# Altium schematic sheet PDB_schematic.SchDoc
size 594 x 420 mm; Organization: ORGANIZATION; Address1: ADDRESS 1; Address2: ADDRESS 2; Address3: ADDRESS 3; Address4: ADDRESS 4; Revision: -; SheetNumber: 1; SheetTotal: 1; ENG_APP_DATE: --/--/--; DSN_APP_DATE: --/--/--; CHK_APP_DATE: --/--/--
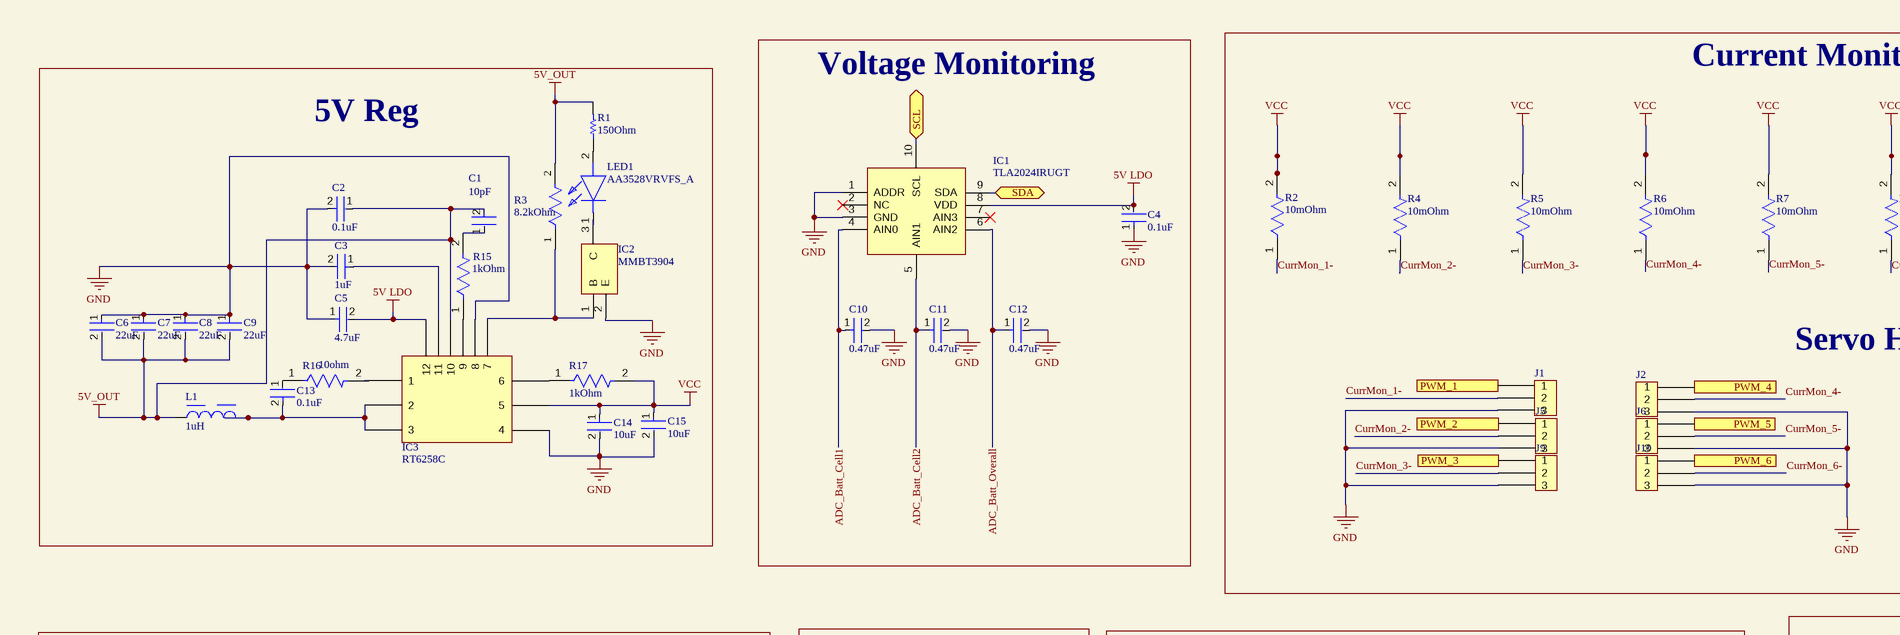
[diagram p0: PDB_schematic.SchDoc, top left]
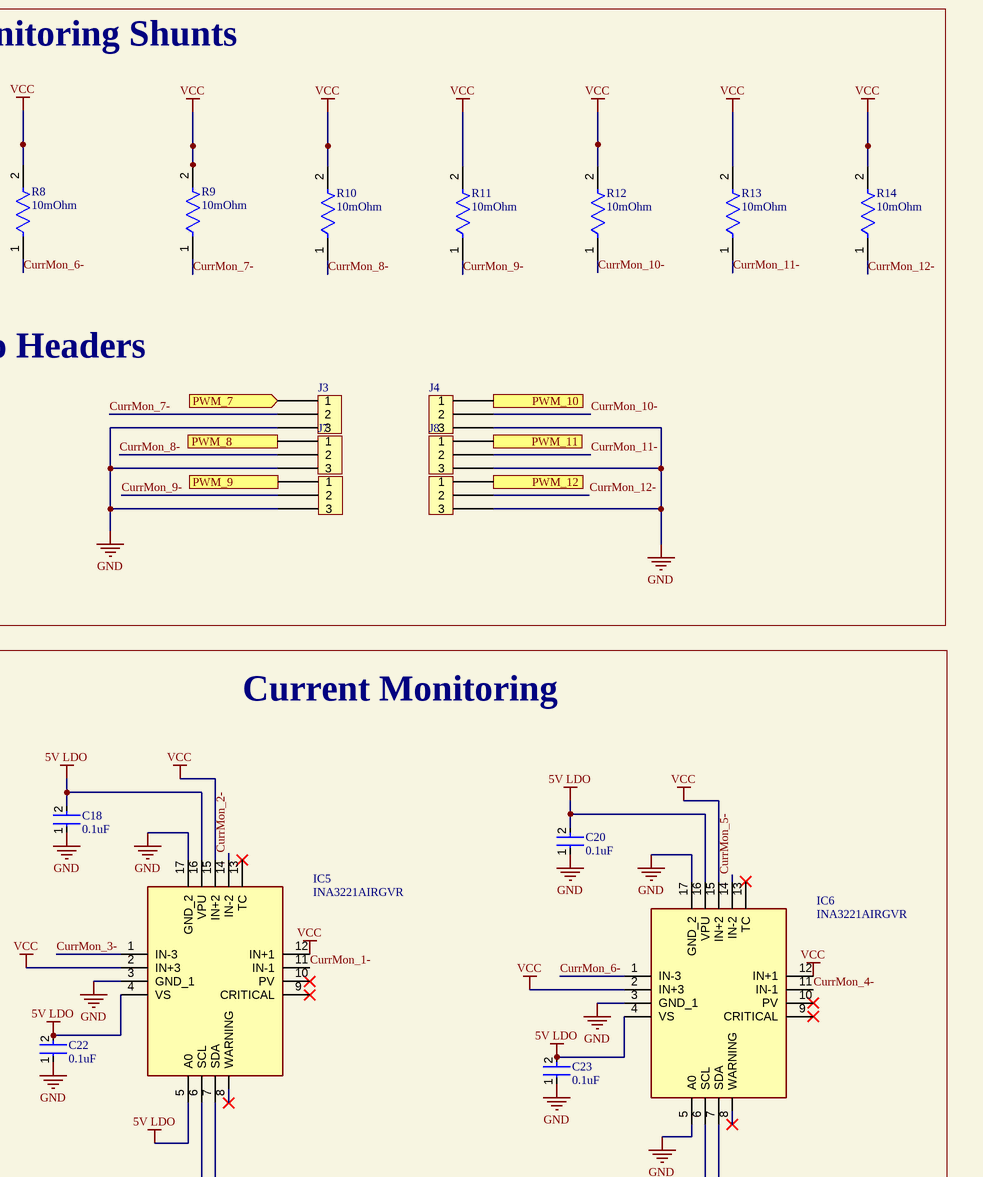
[diagram p1: PDB_schematic.SchDoc, top right]
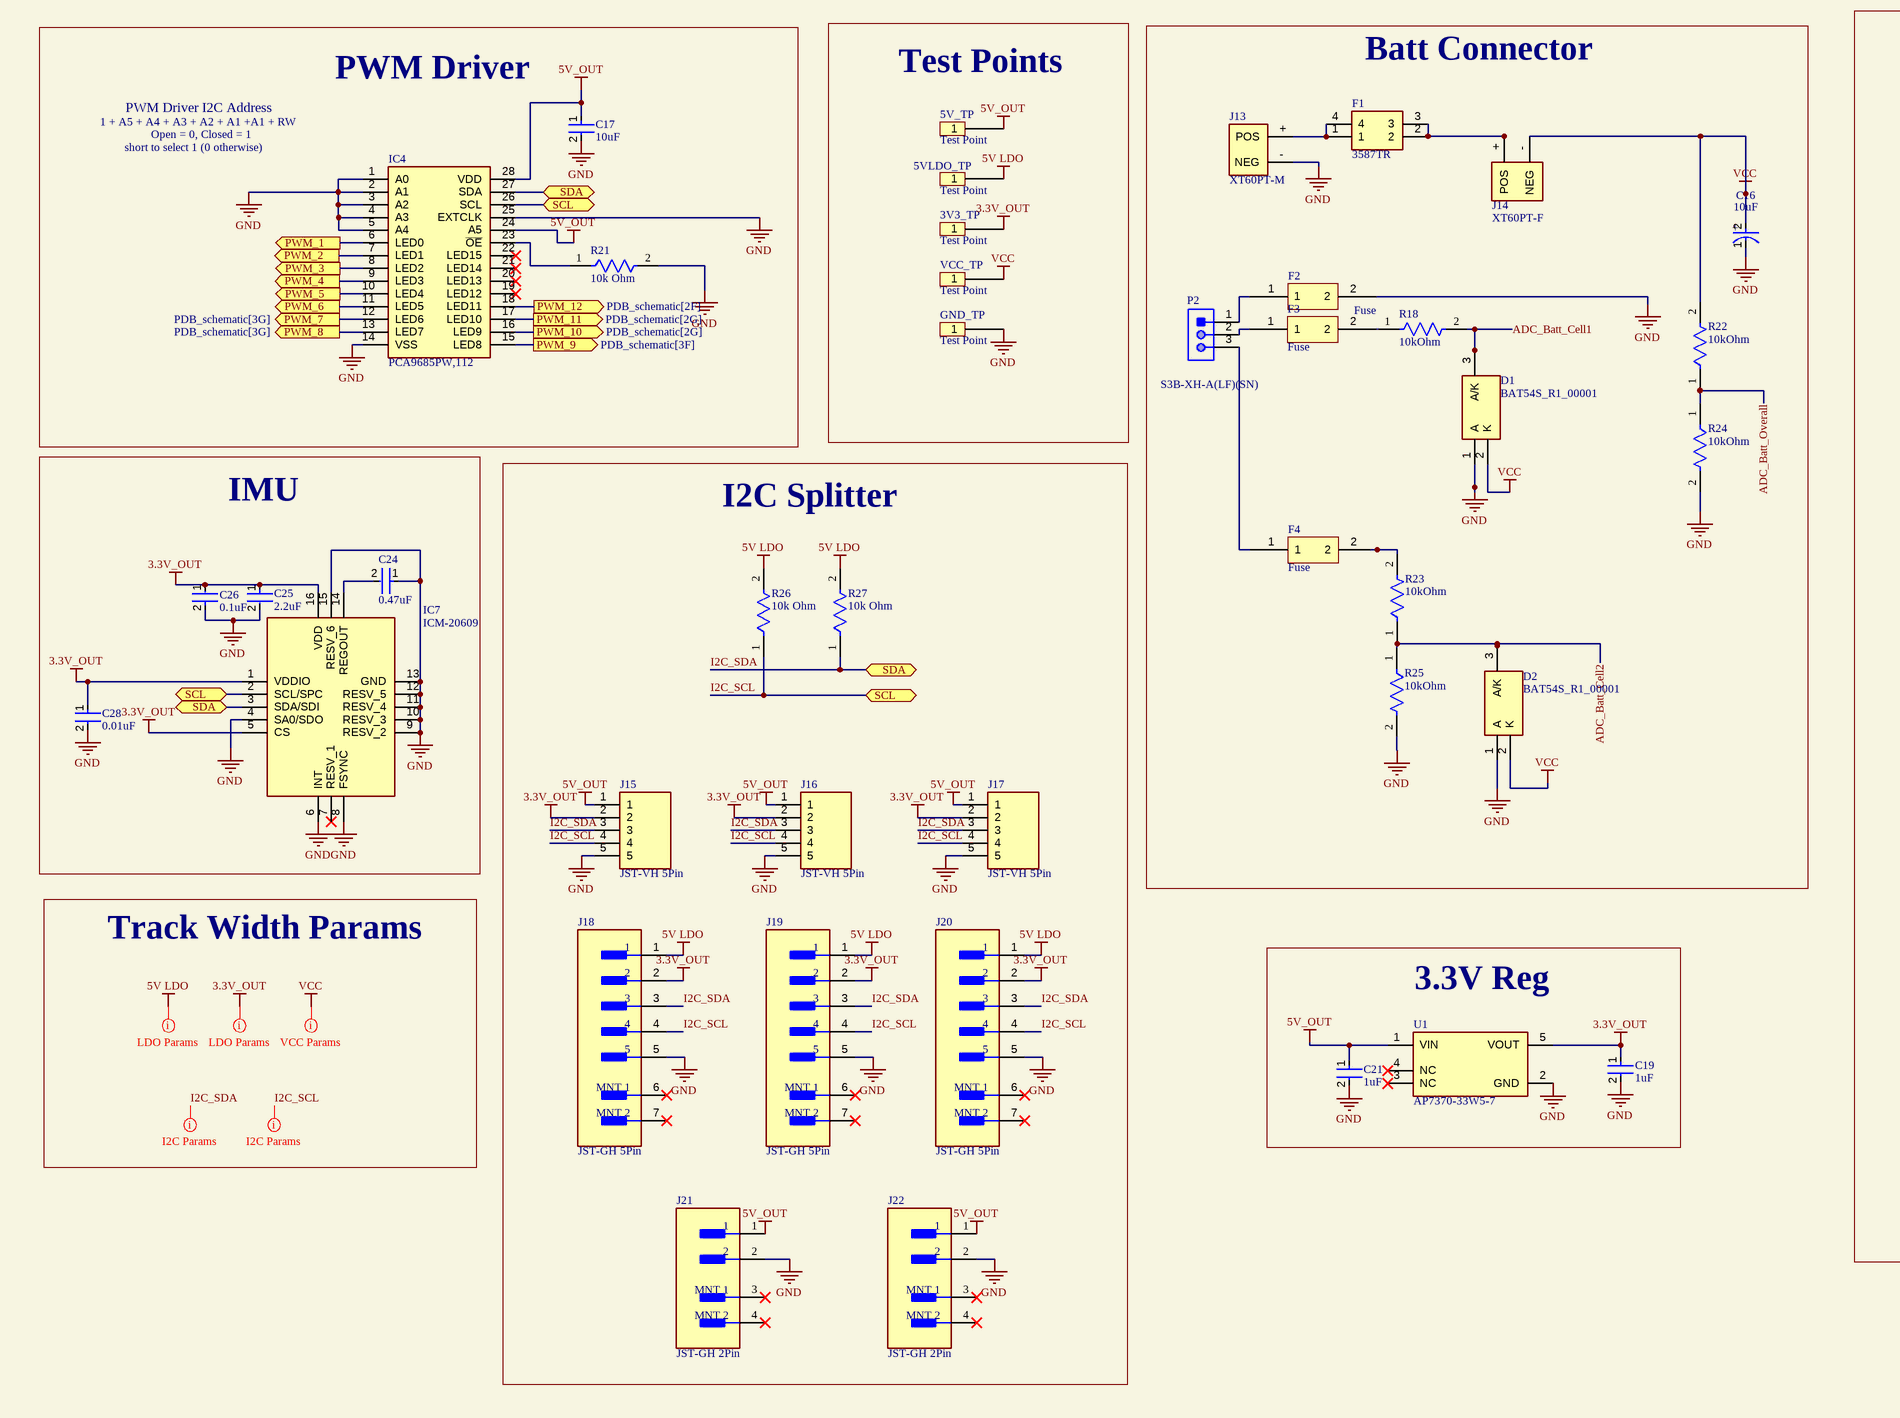
[diagram p2: PDB_schematic.SchDoc, bottom left]
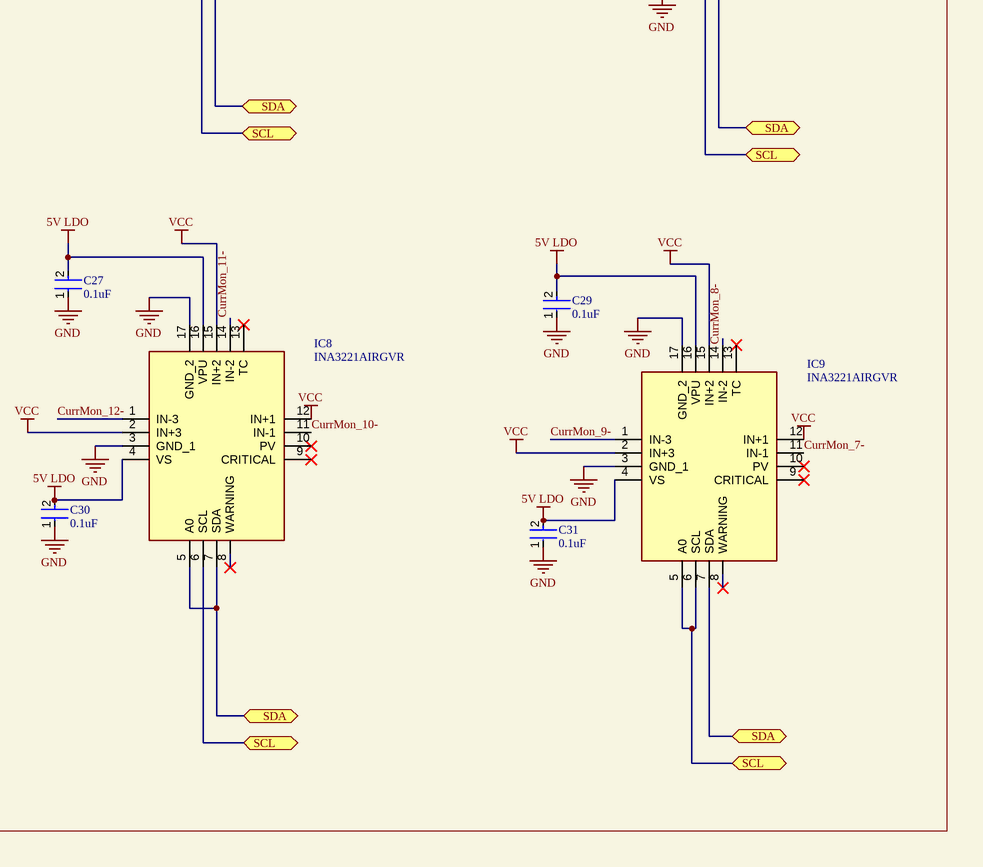
[diagram p3: PDB_schematic.SchDoc, bottom right]

## Parts
3V3_TP  Test Point  [Test Point]
5V_TP  Test Point  [Test Point]
5VLDO_TP  Test Point  [Test Point]
C1  10pF  [FP-C1608-080-0_1-IPC_B]
C2  0.1uF  [FP-GCJ188-0_2-IPC_B]
C3  1uF  [FP-0603-L_1_6_0_15-W_0_81-IPC_B]
C4  0.1uF  [FP-C0603-CJ-IPC_B]
C5  4.7uF  [FP-GRM188-0_2-IPC_B]
C6  22uF  [FP-CL10-IPC_B]
C7  22uF  [FP-CL10-IPC_B]
C8  22uF  [FP-CL10-IPC_B]
C9  22uF  [FP-CL10-IPC_B]
C10  0.47uF  [FP-GRM188-0_1-e0_2_0_5-IPC_B]
C11  0.47uF  [FP-GRM188-0_1-e0_2_0_5-IPC_B]
C12  0.47uF  [FP-GRM188-0_1-e0_2_0_5-IPC_B]
C13  0.1uF  [FP-GCJ188-0_2-IPC_B]
C14  10uF  [FP-GRM188-0_2-IPC_B]
C15  10uF  [FP-GRM188-0_2-IPC_B]
C16  10uF  [FP-FKD-MFG]
C17  10uF  [FP-GRM188-0_1-e0_2_0_55-IPC_B]
C18  0.1uF  [FP-GCJ188-0_2-IPC_B]
C19  1uF  [FP-0603-L_1_6_0_15-W_0_81-IPC_B]
C20  0.1uF  [FP-GCJ188-0_2-IPC_B]
C21  1uF  [FP-0603-L_1_6_0_15-W_0_81-IPC_B]
C22  0.1uF  [FP-GCJ188-0_2-IPC_B]
C23  0.1uF  [FP-GCJ188-0_2-IPC_B]
C24  0.47uF  [FP-GRM188-0_1-e0_2_0_5-IPC_B]
C25  2.2uF  [FP-GRM188-0_1-e0_2_0_5-IPC_B]
C26  0.1uF  [FP-GCJ188-0_2-IPC_B]
C27  0.1uF  [FP-GCJ188-0_2-IPC_B]
C28  0.01uF  [FP-C0603C-CF-IPC_B]
C29  0.1uF  [FP-GCJ188-0_2-IPC_B]
C30  0.1uF  [FP-GCJ188-0_2-IPC_B]
C31  0.1uF  [FP-GCJ188-0_2-IPC_B]
D1  BAT54S_R1_00001  [SOT95P240X110-3N]
D2  BAT54S_R1_00001  [SOT95P240X110-3N]
F1  3587TR  [3587TR]
F2  Fuse  [0805L002YR]
F3  Fuse  [0805L002YR]
F4  Fuse  [0805L002YR]
GND_TP  Test Point  [Test Point]
IC1  TLA2024IRUGT  [ADS1018IRUGT]
IC2  MMBT3904  [SOT95P240X120-3N]
IC3  RT6258C  [RT6258C]
IC4  PCA9685PW,112  [SOP65P640X110-28N]
IC5  INA3221AIRGVR  [QFN65P400X400X100-17N-D]
IC6  INA3221AIRGVR  [QFN65P400X400X100-17N-D]
IC7  ICM-20609  [IAM20680HP]
IC8  INA3221AIRGVR  [QFN65P400X400X100-17N-D]
IC9  INA3221AIRGVR  [QFN65P400X400X100-17N-D]
J1  1x3 dupont  [1x3 Dupont]  (value not drawn)
J2  1x3 dupont  [1x3 Dupont]  (value not drawn)
J3  1x3 dupont  [1x3 Dupont]  (value not drawn)
J4  1x3 dupont  [1x3 Dupont]  (value not drawn)
J5  1x3 dupont  [1x3 Dupont]  (value not drawn)
J6  1x3 dupont  [1x3 Dupont]  (value not drawn)
J7  1x3 dupont  [1x3 Dupont]  (value not drawn)
J8  1x3 dupont  [1x3 Dupont]  (value not drawn)
J9  1x3 dupont  [1x3 Dupont]  (value not drawn)
J10  1x3 dupont  [1x3 Dupont]  (value not drawn)
J11  1x3 dupont  [1x3 Dupont]  (value not drawn)
J12  1x3 dupont  [1x3 Dupont]  (value not drawn)
J13  XT60PT-M  [XT60PT-M]
J14  XT60PT-F  [XT60PT-F]
J15  JST-VH 5Pin  [SHDR5W114P0X396_1X5_1974X850X1090P]
J16  JST-VH 5Pin  [SHDR5W114P0X396_1X5_1974X850X1090P]
J17  JST-VH 5Pin  [SHDR5W114P0X396_1X5_1974X850X1090P]
J18  JST-GH 5Pin  [FP-BM05B-GHS-TBT_LF_SN-MFG]
J19  JST-GH 5Pin  [FP-BM05B-GHS-TBT_LF_SN-MFG]
J20  JST-GH 5Pin  [FP-BM05B-GHS-TBT_LF_SN-MFG]
J21  JST-GH 2Pin  [FP-BM02B-GHS-TBT_LF_SN-MFG]
J22  JST-GH 2Pin  [FP-BM02B-GHS-TBT_LF_SN-MFG]
L1  1uH  [WE-HCI_7040]
LED1  AA3528VRVFS_A  [AA3528VRVFSA]
P2  S3B-XH-A(LF)(SN)  [JST-S3B-XH-A(LF)(SN)_V]
R1  150Ohm  [RESC1608X55X30ML20T20]
R2  10mOhm  [FP-ERJ8CW-IPC_B]
R3  8.2kOhm  [FP-RC0603-0_55-MFG]
R4  10mOhm  [FP-ERJ8CW-IPC_B]
R5  10mOhm  [FP-ERJ8CW-IPC_B]
R6  10mOhm  [FP-ERJ8CW-IPC_B]
R7  10mOhm  [FP-ERJ8CW-IPC_B]
R8  10mOhm  [FP-ERJ8CW-IPC_B]
R9  10mOhm  [FP-ERJ8CW-IPC_B]
R10  10mOhm  [FP-ERJ8CW-IPC_B]
R11  10mOhm  [FP-ERJ8CW-IPC_B]
R12  10mOhm  [FP-ERJ8CW-IPC_B]
R13  10mOhm  [FP-ERJ8CW-IPC_B]
R14  10mOhm  [FP-ERJ8CW-IPC_B]
R15  1kOhm  [FP-ERJ3G-IPC_B]
R16  10ohm  [FP-CR0603-IPC_B]
R17  1kOhm  [FP-ERJ3G-IPC_B]
R18  10kOhm  [FP-ERA3A-IPC_B]
R21  10k Ohm  [FP-ERA3A-IPC_B]
R22  10kOhm  [FP-ERA3A-IPC_B]
R23  10kOhm  [FP-ERA3A-IPC_B]
R24  10kOhm  [FP-ERA3A-IPC_B]
R25  10kOhm  [FP-ERA3A-IPC_B]
R26  10k Ohm  [FP-ERA3A-IPC_B]
R27  10k Ohm  [FP-ERA3A-IPC_B]
U1  AP7370-33W5-7  [FP-SOT25-MFG]
VCC_TP  Test Point  [Test Point]

## Blocks framed on the sheet
Voltage Monitoring: C4 C10-C12 IC1
5V Reg: C1-C3 C5-C9 C13-C15 IC2 IC3 L1 LED1 R1 R3 R15-R17
Test Points: 3V3_TP 5V_TP 5VLDO_TP GND_TP VCC_TP
Batt Connector: C16 D1 D2 F1-F4 J13 J14 P2 R18 R22-R25
Current Monitoring: C18 C20 C22 C23 C27 C29-C31 IC5 IC6 IC8 IC9
PWM Driver: C17 IC4 R21
IMU: C24-C26 C28 IC7
I2C Splitter: J15-J22 R26 R27
3.3V Reg: C19 C21 U1

## Ports
PWM_1 (in, see PDB_schematic[9E]), PWM_1 (out, see PDB_schematic[5G]), PWM_2 (in, see PDB_schematic[9E]), PWM_2 (out, see PDB_schematic[5G]), PWM_3 (in, see PDB_schematic[9E]), PWM_3 (out, see PDB_schematic[5F]), PWM_4 (in, see PDB_schematic[9E]), PWM_4 (out, see PDB_schematic[5G]), PWM_5 (in, see PDB_schematic[9E]), PWM_5 (out, see PDB_schematic[5G]), PWM_6 (in, see PDB_schematic[9E]), PWM_6 (out, see PDB_schematic[5F]), PWM_7 (in, see PDB_schematic[9E]), PWM_7 (out, see PDB_schematic[3G]), PWM_8 (in, see PDB_schematic[9E]), PWM_8 (out, see PDB_schematic[3G]), PWM_9 (in, see PDB_schematic[9E]), PWM_9 (out, see PDB_schematic[3F]), PWM_10 (in, see PDB_schematic[9E]), PWM_10 (out, see PDB_schematic[2G]), PWM_11 (in, see PDB_schematic[9E]), PWM_11 (out, see PDB_schematic[2G]), PWM_12 (in, see PDB_schematic[9E]), PWM_12 (out, see PDB_schematic[2F]), SCL (bidir, see PDB_schematic[2A], PDB_schematic[2D], PDB_schematic[3A], PDB_schematic[3D], PDB_schematic[7H], PDB_schematic[8C], PDB_schematic[9E]), SCL (bidir, see PDB_schematic[2A], PDB_schematic[2D], PDB_schematic[3A], PDB_schematic[3D], PDB_schematic[7H], PDB_schematic[8C], PDB_schematic[10C]), SCL (bidir, see PDB_schematic[2A], PDB_schematic[2D], PDB_schematic[3A], PDB_schematic[3D], PDB_schematic[7H], PDB_schematic[9E], PDB_schematic[10C]), SCL (bidir, see PDB_schematic[2A], PDB_schematic[2D], PDB_schematic[3A], PDB_schematic[3D], PDB_schematic[8C], PDB_schematic[9E], PDB_schematic[10C]), SCL (bidir, see PDB_schematic[2A], PDB_schematic[2D], PDB_schematic[3A], PDB_schematic[7H], PDB_schematic[8C], PDB_schematic[9E], PDB_schematic[10C]), SCL (bidir, see PDB_schematic[2A], PDB_schematic[2D], PDB_schematic[3D], PDB_schematic[7H], PDB_schematic[8C], PDB_schematic[9E], PDB_schematic[10C]), SCL (bidir, see PDB_schematic[2A], PDB_schematic[3A], PDB_schematic[3D], PDB_schematic[7H], PDB_schematic[8C], PDB_schematic[9E], PDB_schematic[10C]), SCL (bidir, see PDB_schematic[2D], PDB_schematic[3A], PDB_schematic[3D], PDB_schematic[7H], PDB_schematic[8C], PDB_schematic[9E], PDB_schematic[10C]), SDA (bidir, see PDB_schematic[2A], PDB_schematic[2D], PDB_schematic[3B], PDB_schematic[3D], PDB_schematic[7H], PDB_schematic[8C], PDB_schematic[9E]), SDA (bidir, see PDB_schematic[2A], PDB_schematic[2D], PDB_schematic[3B], PDB_schematic[3D], PDB_schematic[7H], PDB_schematic[8C], PDB_schematic[10C]), SDA (bidir, see PDB_schematic[2A], PDB_schematic[2D], PDB_schematic[3B], PDB_schematic[3D], PDB_schematic[7H], PDB_schematic[9E], PDB_schematic[10C]), SDA (bidir, see PDB_schematic[2A], PDB_schematic[2D], PDB_schematic[3B], PDB_schematic[3D], PDB_schematic[8C], PDB_schematic[9E], PDB_schematic[10C]), SDA (bidir, see PDB_schematic[2A], PDB_schematic[2D], PDB_schematic[3B], PDB_schematic[7H], PDB_schematic[8C], PDB_schematic[9E], PDB_schematic[10C]), SDA (bidir, see PDB_schematic[2A], PDB_schematic[2D], PDB_schematic[3D], PDB_schematic[7H], PDB_schematic[8C], PDB_schematic[9E], PDB_schematic[10C]), SDA (bidir, see PDB_schematic[2A], PDB_schematic[3B], PDB_schematic[3D], PDB_schematic[7H], PDB_schematic[8C], PDB_schematic[9E], PDB_schematic[10C]), SDA (bidir, see PDB_schematic[2D], PDB_schematic[3B], PDB_schematic[3D], PDB_schematic[7H], PDB_schematic[8C], PDB_schematic[9E], PDB_schematic[10C])

## Nets
3.3V_OUT: 3V3_TP.1 C19.1 C25.1 C26.1 C28.1 IC7.1(VDDIO) IC7.5(CS) IC7.16(VDD) J15.2 J16.2 J17.2 J18.2 J19.2 J20.2 U1.5(VOUT)
5V LDO: 5VLDO_TP.1 C4.2 C5.2 C18.2 C20.2 C22.2 C23.2 C27.2 C29.2 C30.2 C31.2 IC1.8(VDD) IC3.12 IC5.4(VS) IC5.5(A0) IC5.16(VPU) IC6.4(VS) IC6.16(VPU) IC8.4(VS) IC8.16(VPU) IC9.4(VS) IC9.16(VPU) J18.1 J19.1 J20.1 R26.2 R27.2
5V_OUT: 5V_TP.1 C1.2 C2.1 C6.2 C7.2 C8.2 C9.2 C17.1 C21.1 IC3.10 IC4.24(A5) IC4.28(VDD) J15.1 J16.1 J17.1 J21.1 J22.1 L1.1 R1.2 R3.2 U1.1(VIN)
GND: C2.2 C3.2 C4.1 C5.1 C6.1 C7.1 C8.1 C9.1 C10.2 C11.2 C12.2 C14.2 C15.2 C16.1(C) C17.2 C18.1 C19.2 C20.1 C21.2 C22.1 C23.1 C24.1 C25.2 C26.2 C27.1 C28.2 C29.1 C30.1 C31.1 D1.1(A) D2.1(A) F2.2 GND_TP.1 IC1.1(ADDR) IC1.3(GND) IC2.2(E) IC3.4 IC3.8 IC4.1(A0) IC4.2(A1) IC4.3(A2) IC4.4(A3) IC4.5(A4) IC4.14(VSS) IC4.25(EXTCLK) IC5.3(GND_1) IC5.17(GND_2) IC6.3(GND_1) IC6.5(A0) IC6.17(GND_2) IC7.4(SA0/SDO) IC7.6(INT) IC7.8(FSYNC) IC7.9(RESV_2) IC7.10(RESV_3) IC7.11(RESV_4) IC7.12(RESV_5) IC7.13(GND) IC7.15(RESV_6) IC8.3(GND_1) IC8.17(GND_2) IC9.3(GND_1) IC9.17(GND_2) J1.3 J2.3 J3.3 J4.3 J5.3 J6.3 J7.3 J8.3 J9.3 J10.3 J11.3 J12.3 J13.-(NEG) J15.5 J16.5 J17.5 J18.5 J19.5 J20.5 J21.2 J22.2 R21.2 R24.2 R25.2 U1.2(GND)
VCC: C14.1 C15.1 C16.2(A) D1.2(K) D2.2(K) IC3.5 IC5.2(IN+3) IC5.12(IN+1) IC5.15(IN+2) IC6.2(IN+3) IC6.12(IN+1) IC6.15(IN+2) IC8.2(IN+3) IC8.12(IN+1) IC8.15(IN+2) IC9.2(IN+3) IC9.12(IN+1) IC9.15(IN+2) J14.-(NEG) R2.2 R4.2 R5.2 R6.2 R7.2 R8.2 R9.2 R10.2 R11.2 R12.2 R13.2 R14.2 R17.2 R22.2 VCC_TP.1
ADC_Batt_Cell1: C10.1 D1.3(A/K) IC1.4(AIN0) R18.2
ADC_Batt_Cell2: C11.1 D2.3(A/K) IC1.5(AIN1) R23.1 R25.1
ADC_Batt_Overall: C12.1 IC1.6(AIN2) R22.1 R24.1
CurrMon_1-: IC5.11(IN-1) J1.2 R2.1
CurrMon_2-: IC5.14(IN-2) J5.2 R4.1
CurrMon_3-: IC5.1(IN-3) J9.2 R5.1
CurrMon_4-: IC6.11(IN-1) J2.2 R6.1
CurrMon_5-: IC6.14(IN-2) J6.2 R7.1
CurrMon_6-: IC6.1(IN-3) J10.2 R8.1
CurrMon_7-: IC9.11(IN-1) J3.2 R9.1
CurrMon_8-: IC9.14(IN-2) J7.2 R10.1
CurrMon_9-: IC9.1(IN-3) J11.2 R11.1
CurrMon_10-: IC8.11(IN-1) J4.2 R12.1
CurrMon_11-: IC8.14(IN-2) J8.2 R13.1
CurrMon_12-: IC8.1(IN-3) J12.2 R14.1
I2C_SCL: IC1.10(SCL) IC4.26(SCL) IC5.6(SCL) IC6.6(SCL) IC7.2(SCL/SPC) IC8.6(SCL) IC9.5(A0) IC9.6(SCL) J15.4 J16.4 J17.4 J18.4 J19.4 J20.4 R26.1 ; port SCL
I2C_SDA: IC1.9(SDA) IC4.27(SDA) IC5.7(SDA) IC6.7(SDA) IC7.3(SDA/SDI) IC8.5(A0) IC8.7(SDA) IC9.7(SDA) J15.3 J16.3 J17.3 J18.3 J19.3 J20.3 R27.1 ; port SDA
PWM_1: IC4.6(LED0) J1.1 ; port PWM_1
PWM_2: IC4.7(LED1) J5.1 ; port PWM_2
PWM_3: IC4.8(LED2) J9.1 ; port PWM_3
PWM_4: IC4.9(LED3) J2.1 ; port PWM_4
PWM_5: IC4.10(LED4) J6.1 ; port PWM_5
PWM_6: IC4.11(LED5) J10.1 ; port PWM_6
PWM_7: IC4.12(LED6) J3.1 ; port PWM_7
PWM_8: IC4.13(LED7) J7.1 ; port PWM_8
PWM_9: IC4.15(LED8) J11.1 ; port PWM_9
PWM_10: IC4.16(LED9) J4.1 ; port PWM_10
PWM_11: IC4.17(LED10) J8.1 ; port PWM_11
PWM_12: IC4.18(LED11) J12.1 ; port PWM_12
NetC1_1: C1.1 R15.2
NetC3_1: C3.1 IC3.11
NetC13_1: C13.1 R16.1
NetC13_2: C13.2 IC3.2 IC3.3 L1.2
NetC24_2: C24.2 IC7.14(REGOUT)
NetF1_1: F1.1 F1.4 J13.+(POS)
NetF1_2: F1.2 F1.3 J14.+(POS)
NetF2_1: F2.1 P2.1
NetF3_1: F3.1 P2.2
NetF3_2: F3.2 R18.1
NetF4_1: F4.1 P2.3
NetF4_2: F4.2 R23.2
NetIC2_1: IC2.1(B) IC3.7 R3.1
NetIC2_3: IC2.3(C) LED1.1(K)
NetIC3_1: IC3.1 R16.2
NetIC3_6: IC3.6 R17.1
NetIC3_9: IC3.9 R15.1
NetIC4_23: IC4.23(~{OE}) R21.1
NetLED1_2: LED1.2(A) R1.1

Not connected (* = marked no-connect by the designer): IC1 2(NC)* 7(AIN3)*; IC4 19(LED12)* 20(LED13)* 21(LED14)* 22(LED15)*; IC5 8(WARNING)* 9(CRITICAL)* 10(PV)* 13(TC)*; IC6 8(WARNING)* 9(CRITICAL)* 10(PV)* 13(TC)*; IC7 7(RESV_1)*; IC8 8(WARNING)* 9(CRITICAL)* 10(PV)* 13(TC)*; IC9 8(WARNING)* 9(CRITICAL)* 10(PV)* 13(TC)*; J18 6(MNT_1)* 7(MNT_2)*; J19 6(MNT_1)* 7(MNT_2)*; J20 6(MNT_1)* 7(MNT_2)*; J21 3(MNT_1)* 4(MNT_2)*; J22 3(MNT_1)* 4(MNT_2)*; U1 3(NC)* 4(NC)*

## Layout directives
rule Width Constraint [Pref Width = 0.6mm    Min Width = 0.254mm    Max Width = 25mm]: VCC
rule Width Constraint [Pref Width = 0.254mm    Min Width = 0.254mm    Max Width = 0.254mm]: 3.3V_OUT, 5V LDO
rule Width Constraint [Pref Width = 0.178mm    Min Width = 0.178mm    Max Width = 0.305mm]: (no net found under the mark)

## Notes on the sheet
- Current Monitoring Shunts
- Servo Headers
- PWM Driver I2C Address
- 1 + A5 + A4 + A3 + A2 + A1 +A1 + RW
- short to select 1 (0 otherwise)
- Open = 0, Closed = 1
- Track Width Params
- Labels drawn without touching a wire or pin: 3.3V_OUT, 5V LDO, I2C_SCL, I2C_SDA, VCC
- 10
- 9
- 8
- 7
- 6
- 5
- 4
- 3
- DWG. NO.
- 2
- 1
- THIS DOCUMENT AND THE DATA DISCLOSED HEREIN OR HEREWITH IS THE PROPERTY OF ALTIUM LIMITED AND MAY BE FREELY DISTRIBUTED IN WHOLE. NO RIGHTS ARE RESERVED OR EXPRESS OR IMPLIED WARANTEE GIVEN.
- REV.
- SHT.
- REVISION
- DESCRIPTION
- DATE
- APPROVED
- H
- G
- F
- E
- D
- C
- B
- A
- TITLE
- SCALE:
- A2
- SIZE
- CAGE CODE
- FILE NAME
- DWG NO.
- SHEET
- OF
- REV
- (in symbol CMP-2000-06207-2) +

## Library data of the parts
C1 = CMP-08246-005843-1: Multilayer Ceramic Capacitors 10pF ±0.5pF 50V C0G SMD 0603; Temperature Coefficient: 30ppm/°C; Tolerance: 5%; Termination: SMD/SMT; REACH SVHC: No SVHC; Package Quantity: 1; Case Code (Imperial): 0603; Number of Pins: 2; Capacitance: 10pF; Length: 1.6mm; Thickness: 0.037inch; Weight: 7.1E-05oz; Voltage Rating (DC): 50V; RoHS Compliant: Yes; Width: 0.031inch; Depth: 0.8mm; Case/Package: 0603; Dielectric Material: Ceramic; Voltage: 50V; Min Operating Temperature: -55°C; Case Code (Metric): 1608; Mount: Surface Mount; Height: 0.8mm; Construction: Flat; Series: C; Packaging: Tape and Reel; Radiation Hardening: No; Max Operating Temperature: 125°C; Lead Free: Lead Free; Voltage Rating: 50V; Dielectric: C0G
C2 C13 C18 C20 C22 C23 C26 C27 C29-C31 = CMP-06035-047895-1: Cap Ceramic 0.1uF 100V X7R 10% Pad SMD 0603 Soft Termination +125°C Automotive T/R; Capacitance: 100nF; Thickness: 0.035inch; Tolerance: 10%; Packaging: Tape and Reel; Max Operating Temperature: 125°C; Ratings: AEC-Q200; Case/Package: 0603; Length: 0.063inch; Case Code (Imperial): 0603; Min Operating Temperature: -55°C; Width: 0.031inch; Case Code (Metric): 1608; Voltage Rating: 100V; Features: Soft Termination; Mount: Surface Mount; Lead Free: Lead Free
C3 C19 C21 = CMP-2006-04559-3: General Purpose Ceramic Capacitor, 0603, 1uF, 10%, X5R, 15%, 10V; Insulation Resistance: 100GR; Dissipation Factor: 5%; Packaging: Tape and Reel; RoHS Compliant: Yes; Height: 0.9mm; Tolerance: 10%; Length: 1.6mm; Depth: 0.81mm; Case/Package: 0603; Max Operating Temperature: 85°C; Series: -; Dielectric: X5R; Construction: Flat; Capacitance: 1uF; REACH SVHC: No SVHC; Voltage Rating: 10V; Number of Pins: 2; Radiation Hardening: No; Case Code (Imperial): 0603; Min Operating Temperature: -55°C; Termination: SMD/SMT; Contact Plating: Tin; Voltage: 10V; Thickness: 0.035inch; Lead Free: Lead Free; Mount: Surface Mount; Width: 0.81mm; Voltage Rating (DC): 10V; Package Quantity: 4000; Case Code (Metric): 1608
C4 = CMP-2006-03300-2: CAP CER 0.1UF 50V X7R 0603; Manufacturer Part Number: C0603X104K5RACTU; Manufacturer: Kemet; Capacitance: 100nF; Material: Ceramic; Tolerance: 10%; Value: 100nF; Temperature Coefficient: 15%; Temperature Range High: +125°C; Temperature Range Low: -55°C; Voltage: 50V; ComponentLink2Description: Datasheet; RoHS: TRUE; ComponentLink2URL: https://content.kemet.com/datasheets/KEM_C1013_X7R_FT-CAP_SMD.pdf; Device Class L3: Ceramic Capacitors; Device Class L2: Capacitors; Package: C0603-CJ; Height: 0.95mm; Device Class L1: Passive Components; Temperature Characteristic: X7R; Lead Free: Yes; Digikey Description: CAP CER 0.1UF 50V X7R 0603; Automotive: No; Mouser Description: Capacitor; Ceramic; Cap 0.1uF; Tol+10%; SMT; Flexible Termination; Vol-Rtg 50V; TR; Temperature: -55°C to +125°C; Octopart: https://octopart.com/c0603x104k5ractu-kemet-9145062; Category: Cap; Voltage Rating: 50V; Ipc Land Pattern Name: CAPC16080X80
C5 = CMP-2006-02545-2: Chip Multilayer Ceramic Capacitors for General Purpose, 0603, 4.7uF, X5R, 15%, 10%, 35V; Lead Free: Lead Free; Max Operating Temperature: 85°C; Case Code (Imperial): 0603; Capacitance: 4.7uF; Width: 0.8mm; Thickness: 0.031inch; Case Code (Metric): 1608; Min Operating Temperature: -55°C; Voltage Rating (DC): 35V; Dielectric: X5R; Voltage: 35V; Packaging: Tape and Reel; Resistor Type: Ceramic; Weight: 0.000222oz; Mount: Surface Mount; Material: Ceramic; Depth: 0.8mm; Tolerance: 10%; REACH SVHC: No SVHC; Case/Package: 0603; Voltage Rating: 35V; Package Quantity: 4000; Height: 0.8mm; Length: 1.6mm; Termination: SMD/SMT
C6-C9 = CMP-13271-003290-1: Cap Ceramic 22uF 10V X5R ±20% Pad SMD 0603 +85°C T/R; Max Operating Temperature: 85°C; Packaging: Tape and Reel; Mount: Surface Mount; Width: 0.031inch; Length: 0.063inch; Min Operating Temperature: -55°C; Voltage Rating: 10V; Case/Package: 0603; Thickness: 0.037inch; Case Code (Metric): 1608; Tolerance: 20%; Case Code (Imperial): 0603; Capacitance: 22uF
C10-C12 C24 = CMP-2006-02860-2: Chip Multilayer Ceramic Capacitors for General Purpose, 0603, 0.47uF, X7R, 15%, 10%, 16V; Capacitance: 470nF; Material: Ceramic; Termination: SMD/SMT; Case Code (Imperial): 0603; Height: 0.8mm; Dielectric: X7R; Length: 1.6mm; Packaging: Tape and Reel; Mount: Surface Mount; Thickness: 0.035inch; Voltage Rating (DC): 16V; Case Code (Metric): 1608; REACH SVHC: No SVHC; Depth: 0.8mm; Number of Pins: 2; Max Operating Temperature: 125°C; Min Operating Temperature: -55°C; Width: 0.8mm; Voltage: 16V; Lead Free: Lead Free; Voltage Rating: 16V; Package Quantity: 1; Case/Package: 0603; Tolerance: 10%
C14 C15 = CMP-06035-045268-1: Chip Multilayer Ceramic Capacitors for General Purpose, 0603, 10uF, X5R, 15%, 10%, 25V; Case/Package: 0603
C16 = CMP-2000-06207-2: CAP ALUM 10UF 20% 50V SMD; Impedance: 880mR; Ripple Current: 165mA; Polarity: Polar; Leakage Current: 3uA; Lead Diameter: 0.65mm; Life (Hours): 2000Hour; REACH SVHC: No SVHC; Series: FK; Max Operating Temperature: 105°C; Radiation Hardening: No; Size: 5.8mm; Ripple Current (AC): 165mA; Lead Free: Lead Free; Voltage: 50V; Contact Plating: Tin; Case/Package: Radial; RoHS Compliant: Yes; Voltage Rating: 50V; Height - Seated (Max): 0.24inch; Package Quantity: 1000; Termination: SMD/SMT; Number of Pins: 2; Mount: Surface Mount; Packaging: Tape and Reel; Length: 5.8mm; Width: 7.8mm; Min Operating Temperature: -55°C; Height: 5.8mm; ESR (Equivalent Series Resistance): 880mR; Capacitance: 10uF; Diameter: 6.3mm; Voltage Rating (DC): 50V; Construction: Cylindrical; Tolerance: 20%; Lead Pitch: 1.8mm
C17 = CMP-2006-02792-2: Chip Multilayer Ceramic Capacitors for General Purpose, 0603, 10uF, X5R, 15%, 20%, 6.3V; Packaging: Tape and Reel; Voltage Rating (DC): 6.3V; Width: 0.031inch; Termination: SMD/SMT; Dielectric: X5R; Package Quantity: 4000; Voltage Rating: 6.3V; Capacitance: 10uF; Case/Package: 0603; Min Operating Temperature: -55°C; Voltage: 6.3V; Length: 1.6mm; Thickness: 0.035inch; Lead Free: Lead Free; Depth: 0.8mm; Case Code (Imperial): 0603; Max Operating Temperature: 85°C; Material: Ceramic; Height: 0.8mm; Tolerance: 20%; Mount: Surface Mount; REACH SVHC: No SVHC; Radiation Hardening: No; Case Code (Metric): 1608
C25 = CMP-2006-02836-2: Chip Multilayer Ceramic Capacitors for General Purpose, 0603, 2.2uF, X7R, 15%, 10%, 10V; Case Code (Metric): 1608; Height: 0.8mm; Packaging: Cut Tape; Voltage: 10V; Lead Free: Lead Free; Min Operating Temperature: -55°C; Voltage Rating (DC): 10V; Max Operating Temperature: 125°C; Voltage Rating: 10V; Dielectric: X7R; Depth: 0.8mm; Case Code (Imperial): 0603; Termination: SMD/SMT; Case/Package: 0603; Number of Pins: 2; REACH SVHC: No SVHC; Mount: Surface Mount; Width: 0.031inch; Material: Ceramic; Capacitance: 2.2uF; Package Quantity: 1; Weight: 7.1E-05oz; Length: 1.6mm; Thickness: 0.035inch; Tolerance: 10%
C28 = CMP-2006-03038-2: CAP CER 10000PF 200V X7R 0603; Manufacturer: KEMET; Manufacturer Part Number: C0603C103K2RACTU; Material: Ceramic; Value: 10,000 pF; Temperature Coefficient: 30ppm/°C; Tolerance: 0.1; Automotive Grade: Grade 1; Voltage Rating: 200 V; ComponentLink2Description: Datasheet; Package: C0603C-CF; Device Class L2: Capacitors; Mouser Description: Multilayer Ceramic Capacitors MLCC - SMD/SMT 200volts 10000pF X7R 10%; Device Class L3: Ceramic Capacitors; Temperature Range Low: -55°C; Category: Cap; Device Class L1: Passive Components; Lead Free: Yes; Octopart: https://octopart.com/c0603c103k2ractu-kemet-1061947; ComponentLink2URL: https://api.kemet.com/component-edge/download/datasheet/C0603C100J5GACAUTO.pdf; Temperature Characteristic: X7R; Temperature: -55°C to +125°C; Automotive: Yes; Temperature Range High: +125°C; Digikey Description: CAP CER 10000PF 200V X7R 0603; Height: 0.87mm; RoHS: TRUE; Capacitance: 10,000 pF
D1 D2 = BAT54S_R1_00001: Schottky Diode; Manufacturer_Name: PANJIT; Datasheet Link: https://www.mouser.tw/datasheet/2/1057/BAT54_SERIES-1868754.pdf; Height: 1.1mm; Manufacturer_Part_Number: BAT54S_R1_00001; Mouser Part Number: 241-BAT54S_R1_00001; Mouser Price/Stock: https://www.mouser.co.uk/ProductDetail/Panjit/BAT54S_R1_00001?qs=sPbYRqrBIVkGy01tP2E0cg%3D%3D
F1 = 3587TR: Undefined or Miscellaneous; Manufacturer_Name: Keystone Electronics; Datasheet Link: http://www.farnell.com/datasheets/1808776.pdf?_ga=2.103221312.1702246963.1549295119-2039790547.1549295119; Height: 7.4mm; Manufacturer_Part_Number: 3587TR; Mouser Part Number: 534-3587TR; Mouser Price/Stock: https://www.mouser.co.uk/ProductDetail/Keystone-Electronics/3587TR?qs=BMR1h6ig6pDMLAvCoDyZvg%3D%3D
F2-F4 = 0805L002YR
IC1 = TLA2024IRUGT: Integrated Circuit; Manufacturer_Name: Texas Instruments; Datasheet Link: http://www.ti.com/lit/ds/sbas846/sbas846.pdf; Height: 0.4mm; Manufacturer_Part_Number: TLA2024IRUGT; Mouser Part Number: 595-TLA2024IRUGT; Mouser Price/Stock: https://www.mouser.co.uk/ProductDetail/Texas-Instruments/TLA2024IRUGT?qs=chTDxNqvsylxt6cbA39OGw%3D%3D; Arrow Part Number: TLA2024IRUGT; Arrow Price/Stock: https://www.arrow.com/en/products/tla2024irugt/texas-instruments?region=nac
IC2 = MMBT3904: Integrated Circuit; Manufacturer_Name: Diotec; Datasheet Link: https://media.digikey.com/pdf/Data%20Sheets/ON%20Semiconductor%20PDFs/2N3904,MMBT3904,PZT3904.pdf; Height: 1.2mm; Manufacturer_Part_Number: MMBT3904; Mouser Part Number: 637-MMBT3904; Mouser Price/Stock: https://www.mouser.co.uk/ProductDetail/Diotec-Semiconductor/MMBT3904?qs=OlC7AqGiEDkK1MwiyUU6mg%3D%3D; Arrow Part Number: MMBT3904; Arrow Price/Stock: https://www.arrow.com/en/products/mmbt3904/diotec-semiconductor-ag?region=europe
IC3 = RT6258C: 5V 8A REG with LDO
IC4 = PCA9685PW,112: Integrated Circuit; Manufacturer_Name: NXP; Datasheet Link: http://www.nxp.com/docs/en/data-sheet/PCA9685.pdf; Height: 1.1mm; Manufacturer_Part_Number: PCA9685PW,112; Mouser Part Number: 771-PCA9685PW,112; Mouser Price/Stock: https://www.mouser.co.uk/ProductDetail/NXP-Semiconductors/PCA9685PW112?qs=6YAT8rHPFU9wZqiAeiOMZw%3D%3D; Arrow Part Number: PCA9685PW,112; Arrow Price/Stock: https://www.arrow.com/en/products/pca9685pw112/nxp-semiconductors?region=nac
IC5 IC6 IC8 IC9 = INA3221AIRGVR: Integrated Circuit; Manufacturer_Name: Texas Instruments; Datasheet Link: http://www.ti.com/lit/ds/symlink/ina3221.pdf; Height: 1mm; Manufacturer_Part_Number: INA3221AIRGVR; Mouser Part Number: 595-INA3221AIRGVR; Mouser Price/Stock: https://www.mouser.co.uk/ProductDetail/Texas-Instruments/INA3221AIRGVR?qs=3AcK5DacLboHys8907TVUQ%3D%3D; Arrow Part Number: INA3221AIRGVR; Arrow Price/Stock: https://www.arrow.com/en/products/ina3221airgvr/texas-instruments?region=nac
IC7 = ICM-20609: Integrated Circuit; Manufacturer_Name: TDK; Datasheet Link: https://3cfeqx1hf82y3xcoull08ihx-wpengine.netdna-ssl.com/wp-content/uploads/2021/03/DS-000135-ICG-20660-TYP-v1.2.pdf; Manufacturer_Part_Number: ICM-20609; Arrow Part Number: ICM-20609; Arrow Price/Stock: https://www.arrow.com/en/products/icm-20609/invensense?region=nac
J1-J12 = 1x3 dupont: Connector; Manufacturer_Name: SAMTEC; Manufacturer_Part_Number: TSW-106-07-L-T; Datasheet Link: http://suddendocs.samtec.com/catalog_english/tsw_th.pdf; Height: 8.38mm; Mouser Part Number: 200-TSW10607LT; Mouser Price/Stock: https://www.mouser.co.uk/ProductDetail/Samtec/TSW-106-07-L-T?qs=rU5fayqh%252BE39iyDwG6o8Cg%3D%3D; Arrow Part Number: TSW-106-07-L-T; Arrow Price/Stock: https://www.arrow.com/en/products/tsw-106-07-l-t/samtec
J13 = XT60PT-M: Male SMT XT60 Connector
J14 = XT60PT-F: Female SMT XT60 Connector
J15-J17 = _D__B5P-VH-BK__LF__SN_: Connector; Manufacturer_Name: JST (JAPAN SOLDERLESS TERMINALS); Manufacturer_Part_Number: (D) B5P-VH-BK (LF)(SN); Datasheet Link: https://www.jst-mfg.com/product/pdf/eng/eVH.pdf; Height: 10.9mm; Mouser Part Number: N/A; Mouser Price/Stock: https://www.mouser.co.uk/ProductDetail/JST/D-B5P-VH-BK-LFSN?qs=wnTfsH77Xs6D1q6ZybO7cA%3D%3D
J18-J20 = CMP-17439-000046-1: CONN HEADER SMD 5POS 1.25MM; Pitch: 0.049inch; Number of Positions: 5; Connector Type: Outer Shroud Contact; Fastening Type: Ramp; Packaging: Cut Tape; Contact Plating: Tin; Termination: Solder; Number of Pins: 5; Color: Natural; Number of Rows: 1; Mount: Surface Mount; Lead Free: Lead Free
J21 J22 = CMP-2000-05957-2: CONN HEADER SMD 2POS 1.25MM; Pitch: 0.049inch; Connector Type: Outer Shroud Contact; Number of Positions: 2; Packaging: Tape and Reel; Lead Free: Lead Free; Termination: Solder; Fastening Type: Ramp; Number of Rows: 1; Color: Natural; Contact Plating: Tin; Mount: Surface Mount
L1 = CMP-0226-00067-2: NexarPartId: 20056790; Inductance: 1µH; Tolerance: 20%; Current Rating: 15A; Series Resistance: 4.6Ω; Test Frequency: 100kHz; Shielding: Shielded; Self Resonant Frequency: 85MHz; DC Resistance (DCR): 4.6mΩ; Saturation Current: 19A; RoHS: Compliant; REACH SVHC: Unknown; Case/Package: Nonstandard; Termination: SMD/SMT; Ambient Temperature Range High: 100°C; Height: 3.8mm; Packaging: Digi-Reel®; Height - Seated (Max): 3.9878mm; Width: 6.9mm; Max Operating Temperature: 150°C; Length: 7mm; Mount: Surface Mount; Number of Pins: 2; Ambient Temperature Range Low: -40°C; Max DC Current: 15A; Inductance Tolerance: 20%; Composition: Wirewound; Min Operating Temperature: -40°C; RMS Current (Irms): 15A
LED1 = AA3528VRVFS_A: LED; Manufacturer_Name: Kingbright; Manufacturer_Part_Number: AA3528VRVFS/A; Datasheet Link: https://mouser.componentsearchengine.com/Datasheets/1/AA3528VRVFS_A.pdf; Height: 2.1mm; Mouser Part Number: 604-AA3528VRVFS/A; Mouser Price/Stock: https://www.mouser.co.uk/ProductDetail/Kingbright/AA3528VRVFS-A?qs=rY7msk5yxfb63mh907EyRA%3D%3D; Arrow Part Number: AA3528VRVFS/A; Arrow Price/Stock: https://www.arrow.com/en/products/aa3528vrvfsa/kingbright?region=nac
P2 = CMP-1755-00006-1: Male Header, Pitch 2.5 mm, 1 x 3 Position, Height 6.1 mm, Tail Length 3.4 mm, -25 to 85 degC, RoHS, Bulk; Min Supply Voltage: 1 V; Frequency: 1.8 MHz; Channels: 1; Nominal Supply Current: 170 uA; Max Power Dissipation: 1 W; Max Ouput Current: -10 mA; Case\Package: DIP; Max Supply Voltage: 15 V; Min Operating Temperature: 0 degC; Weight: 0.015535 oz; Radiation Hardening: No; ComponentLink1URL: http://www.jst.com/home2.html; PackageReference: S3B-XH-A(LF)(SN); Length: 9.81 mm; Max Operating Temperature: 70 degC; Package Quantity: 50; REACH SVHC: No SVHC; Mount: Through Hole; Pins: 8; Height: 4.57 mm; DatasheetVersion: May-16; ComponentLink1Description: Manufacturer URL; PackageDescription: Male Header, Pitch 2.5 mm, 1 x 3 Position, Height 6.1 mm, Tail Length 3.4 mm; RoHSCompliant: true; Packaging: Rail/Tube; Width: 6.35 mm; ComponentLink2URL: http://www.jst-mfg.com/product/pdf/eng/eXH.pdf; ComponentLink2Description: Datasheet
R1 = CMP-2000-00914-1: Part Number: ERA3AEB151V; Manufacturer: Panasonic
R2 R4-R14 = CMP-2003-00786-2: RES 0.01 OHM 1% 1W 1206; Temperature Coefficient: 75ppm/°C; Resistance: 10mR; Military Standard: Not; Depth: 1.6mm; Mount: Surface Mount; Resistor Type: Thick Film; Termination: Flat; Features: Automotive AEC-Q200; Number of Terminations: 2; Max Power Dissipation: 1W; Tolerance: 1%; Case Code (Imperial): 1206; Max Operating Temperature: 125°C; Case Code (Metric): 3216; Lead Free: Lead Free; Case/Package: 1206; Power Rating: 1W; Width: 0.063inch; Packaging: Cut Tape; Length: 3.2mm; Height: 0.03inch; REACH SVHC: No SVHC; Min Operating Temperature: -55°C
R3 = CMP-1659-00040-2: NexarPartId: 40301092; Voltage Rating (AC): 50V; Resistance: 8.2kΩ; Power Rating: 100mW; Temperature Coefficient: 100ppm/°C; Tolerance: 1%; Number of Terminations: 2; Length: 1.6mm; Height: 450µm; Composition: Thick Film; Case Code (Imperial): 0603; Features: Moisture Resistant; Width: 800µm; Max Operating Temperature: 155°C; Lead Pitch: 300µm; Voltage Rating: 50V; Termination: SMD/SMT; Case Code (Metric): 1608; Max Power Dissipation: 100mW; REACH SVHC: No SVHC; Number of Pins: 2; Min Operating Temperature: -55°C; Case/Package: 0603; Packaging: Tape & Reel; Voltage Rating (DC): 50V; Schedule B: 8533210045, 8533210045; Lead Free: Lead Free; RoHS: Compliant; Military Standard: Not; Depth: 800µm
R15 R17 = CMP-2000-00703-2: RES SMD 1K OHM 5% 1/10W 0603; Manufacturer: Panasonic; Manufacturer Part Number: ERJ-3GEYJ102V; Resistance: 1000Ω; Voltage: 75 V; Power Rating: 0.1W; Temperature Coefficient: 200ppm/°C; Voltage Rating: 75V; Value: 1000Ω; Automotive Grade: Grade 0; Category: Res; Ipc Land Pattern Name: RESC16080X45; Mounting Type: surface mount; Octopart: https://octopart.com/erj-3geyj102v-panasonic-55403670; Automotive: Yes; Temperature: -55°C to +155°C; ComponentLink2Description: Datasheet; Lead Free: Yes; Footprint Url: https://industrial.panasonic.com/cdbs/www-data/pdf/RDA0000/DMA0000COL17.pdf; Tolerance: 5%; Device Class L1: Passive Components; Height: 0.55mm; Temperature Range Low: -55°C; RoHS: TRUE; Package: ERJ3G; ComponentLink2URL: https://industrial.panasonic.com/cdbs/www-data/pdf/RDA0000/AOA0000C301.pdf; Temperature Range High: +155°C; Digikey Description: RES SMD 1K OHM 5% 1/10W 0603; Series: ERJ; Device Class L2: Resistors; Device Class L3: Chip SMD Resistors; Mouser Description: Res Thick Film 0603 1K Ohm 5% 1/10W ±200ppm/°C Molded SMD Punched Carrier T/R; Composition: Thick Film
R16 = CMP-1012-00284-2: Thick Film Chip Resistors 0603 10Ω 0.1W 1% 100ppm/°C; Max Power Dissipation: 100mW; Resistance: 10R; Voltage Rating: 50V; Depth: 0.8mm; REACH SVHC: No SVHC; Package Quantity: 1; Thickness: 457um; Length: 1.6mm; Tolerance: 1%; Width: 0.8mm; Number of Pins: 2; Height: 0.45mm; Military Standard: Not; Features: Moisture Resistant; Packaging: Tape and Reel; Case/Package: 0603; Power Rating: 100mW; Voltage Rating (DC): 50V; Radiation Hardening: No; Mount: Surface Mount; Min Operating Temperature: -55°C; Composition: Thick Film; Max Operating Temperature: 155°C; Termination: SMD/SMT; Temperature Coefficient: 100ppm/°C; Case Code (Imperial): 0603; Case Code (Metric): 1608; Number of Terminations: 2; Contact Plating: Tin
R18 R21-R27 = CMP-2000-00874-2: RES SMD 10K OHM 0.1% 1/10W 0603; Voltage Rating (DC): 75V; Power Rating: 100mW; Resistance: 10kR; Temperature Coefficient: 25ppm/°C; Radiation Hardening: No; Width: 0.8mm; Depth: 0.8mm; Construction: Rectangular; Case Code (Metric): 1608; Package Quantity: 5000; Length: 1.6mm; Size Code: 0603; Case Code (Imperial): 0603; Termination: SMD/SMT; Contact Plating: Tin; Resistance Tolerance: 0.1%; Military Standard: Not; Packaging: Tape and Reel; Max Power Dissipation: 100mW; REACH SVHC: No SVHC; Series: ERA-3A; Voltage Rating: 75V; Lead Free: Lead Free; Technology: METAL FILM; RoHS Compliant: Yes; Max Operating Temperature: 155°C; Resistor Type: Thin Film; Min Operating Temperature: -55°C; Number of Pins: 2; Case/Package: 0603; Tolerance: 0.1%; Height: 0.45mm; Mount: Surface Mount; Number of Terminations: 2
U1 = CMP-12756-000029-1: LDO CMOS LOWCURR SOT25